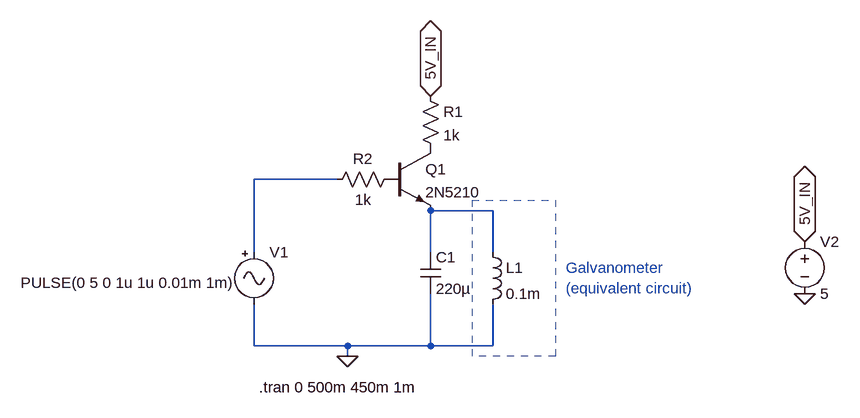
[diagram p0: schematic DAC_PWM_output_circuit.asc]
DAC_PWM_output_circuit.asc, the LTspice schematic file:
Version 4
SHEET 1 988 680
WIRE 176 16 48 16
WIRE 416 64 320 64
WIRE 48 128 48 16
WIRE 320 128 320 64
WIRE 416 128 416 64
WIRE 48 272 48 208
WIRE 192 272 48 272
WIRE 320 272 320 192
WIRE 320 272 192 272
WIRE 416 272 416 208
WIRE 416 272 320 272
WIRE 192 288 192 272
FLAG 192 288 0
FLAG 896 192 0
FLAG 896 112 5V_IN
IOPIN 896 112 BiDir
FLAG 320 -112 5V_IN
IOPIN 320 -112 BiDir
SYMBOL Misc\\signal 48 112 R0
WINDOW 3 -359 63 Left 2
WINDOW 123 0 0 Left 2
WINDOW 39 -251 101 Left 2
SYMATTR Value PULSE(0 5 0 1u 1u 0.01m 1m)
SYMATTR InstName V1
SYMBOL cap 304 128 R0
SYMATTR InstName C1
SYMATTR Value 220µ
SYMBOL npn 256 -32 R0
SYMATTR InstName Q1
SYMATTR Value 2N5210
SYMBOL res 272 0 R90
WINDOW 0 0 56 VBottom 2
WINDOW 3 32 56 VTop 2
SYMATTR InstName R2
SYMATTR Value 1k
SYMBOL voltage 896 96 R0
WINDOW 123 0 0 Left 2
WINDOW 39 0 0 Left 2
SYMATTR InstName V2
SYMATTR Value 5
SYMBOL ind 400 112 R0
SYMATTR InstName L1
SYMATTR Value 0.1m
SYMATTR SpiceLine Rser=107
SYMBOL res 304 -128 R0
SYMATTR InstName R1
SYMATTR Value 1k
TEXT 56 336 Left 2 !.tran 0 500m 450m 1m
TEXT 528 152 Left 2 ;Galvanometer\n(equivalent circuit)
RECTANGLE Normal 512 288 384 48 2

The netlist it stands for:
* DAC_PWM_output_circuit.asc
V1 N001 0 PULSE(0 5 0 1u 1u 0.01m 1m)
C1 N002 0 220µ
Q1 P001 P002 N002 0 2N5210
R2 P002 N001 1k
V2 5V_IN 0 5
L1 N002 0 0.1m Rser=107
R1 5V_IN P001 1k
.model NPN NPN
.model PNP PNP
.lib standard.bjt
.tran 0 500m 450m 1m
* Galvanometer
* (equivalent circuit)
.backanno
.end